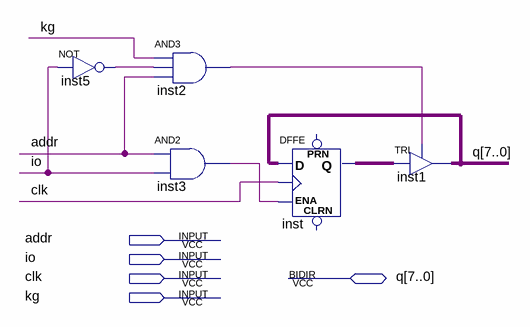
[diagram p0: schematic sheet]
// Quartus schematic cchdy.bdf as structural Verilog: 5 symbols, 5 pins
module cchdy (
  input  addr,
  input  io,
  input  clk,
  input  kg,
  inout  [7:0] q
);

  wire inst2_out, inst3_out, inst5_out;
  wire [7:0] inst_q;

  not inst5 (inst5_out, io);
  and inst2 (inst2_out, kg, inst5_out, addr);
  and inst3 (inst3_out, addr, io);
  DFFE inst[7:0] (.D(q), .CLK(clk), .ENA(inst3_out), .Q(inst_q));  // open: PRN, CLRN
  TRI inst1[7:0] (.IN(inst_q), .OE(inst2_out), .OUT(q));
endmodule
